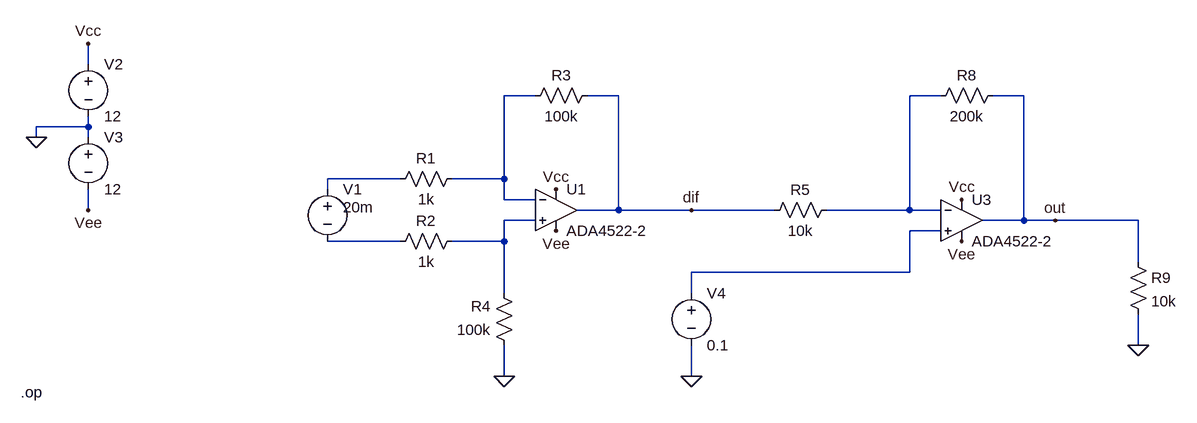
[diagram p0: schematic DiffAmp.asc]
DiffAmp.asc, the LTspice schematic file:
Version 4
SHEET 1 1000 680
WIRE -752 -48 -752 -80
WIRE -64 0 -112 0
WIRE 64 0 16 0
WIRE 560 0 512 0
WIRE 688 0 640 0
WIRE -752 48 -752 32
WIRE -752 48 -832 48
WIRE -832 64 -832 48
WIRE -752 64 -752 48
WIRE -272 128 -384 128
WIRE -112 128 -112 0
WIRE -112 128 -192 128
WIRE -384 144 -384 128
WIRE -112 160 -112 128
WIRE -64 160 -112 160
WIRE -752 176 -752 144
WIRE 64 176 64 0
WIRE 64 176 0 176
WIRE 176 176 64 176
WIRE 304 176 176 176
WIRE 512 176 512 0
WIRE 512 176 384 176
WIRE 560 176 512 176
WIRE -64 192 -112 192
WIRE 688 192 688 0
WIRE 688 192 624 192
WIRE 736 192 688 192
WIRE 864 192 736 192
WIRE 560 208 512 208
WIRE -272 224 -384 224
WIRE -112 224 -112 192
WIRE -112 224 -192 224
WIRE 864 256 864 192
WIRE 512 272 512 208
WIRE 512 272 176 272
WIRE -112 304 -112 224
WIRE 176 304 176 272
WIRE 864 384 864 336
WIRE -112 432 -112 384
WIRE 176 432 176 384
FLAG -112 432 0
FLAG -832 64 0
FLAG -752 -80 Vcc
FLAG -32 144 Vcc
FLAG -752 176 Vee
FLAG -32 208 Vee
FLAG 864 384 0
FLAG 176 176 dif
FLAG 736 192 out
FLAG 592 160 Vcc
FLAG 592 224 Vee
FLAG 176 432 0
DATAFLAG -144 128 ""
DATAFLAG -144 224 ""
DATAFLAG 144 176 ""
DATAFLAG 864 192 ""
SYMBOL ADA4522-2 -32 112 R0
SYMATTR InstName U1
SYMBOL res -176 112 R90
WINDOW 0 0 56 VBottom 2
WINDOW 3 32 56 VTop 2
SYMATTR InstName R1
SYMATTR Value 1k
SYMBOL res -176 208 R90
WINDOW 0 0 56 VBottom 2
WINDOW 3 32 56 VTop 2
SYMATTR InstName R2
SYMATTR Value 1k
SYMBOL res 32 -16 R90
WINDOW 0 0 56 VBottom 2
WINDOW 3 32 56 VTop 2
SYMATTR InstName R3
SYMATTR Value 100k
SYMBOL res -96 400 R180
WINDOW 0 36 76 Left 2
WINDOW 3 36 40 Left 2
SYMATTR InstName R4
SYMATTR Value 100k
SYMBOL res 288 192 R270
WINDOW 0 32 56 VTop 2
WINDOW 3 0 56 VBottom 2
SYMATTR InstName R5
SYMATTR Value 10k
SYMBOL res 544 16 R270
WINDOW 0 32 56 VTop 2
WINDOW 3 0 56 VBottom 2
SYMATTR InstName R8
SYMATTR Value 200k
SYMBOL voltage -752 -64 R0
WINDOW 123 0 0 Left 0
WINDOW 39 0 0 Left 0
SYMATTR InstName V2
SYMATTR Value 12
SYMBOL voltage -752 48 R0
WINDOW 123 0 0 Left 0
WINDOW 39 0 0 Left 0
SYMATTR InstName V3
SYMATTR Value 12
SYMBOL voltage -384 128 R0
WINDOW 39 0 0 Left 0
WINDOW 3 24 44 Left 2
SYMATTR Value 20m
SYMATTR Value2 AC 50m 0
SYMATTR InstName V1
SYMBOL res 848 240 R0
SYMATTR InstName R9
SYMATTR Value 10k
SYMBOL ADA4522-2 592 128 R0
SYMATTR InstName U3
SYMBOL voltage 176 288 R0
WINDOW 123 0 0 Left 0
WINDOW 39 0 0 Left 0
SYMATTR InstName V4
SYMATTR Value 0.1
TEXT -856 456 Left 2 !.op

The netlist it stands for:
* DiffAmp.asc
XU1 N004 N001 Vcc Vee dif ADA4522  ; ADA4522-2, pins In+ In- V+ V- OUT
R1 N001 N003 1k
R2 N004 N006 1k
R3 dif N001 100k
R4 0 N004 100k
R5 dif N002 10k
R8 N002 out 200k
V2 Vcc 0 12
V3 0 Vee 12
V1 N003 N006 20m AC 50m 0
R9 out 0 10k
XU3 N005 N002 Vcc Vee out ADA4522  ; ADA4522-2, pins In+ In- V+ V- OUT
V4 N005 0 0.1
.op
.lib ADA4522.lib
.backanno
.end